# Altium schematic sheet Current Sense - AMS.SchDoc
size A4
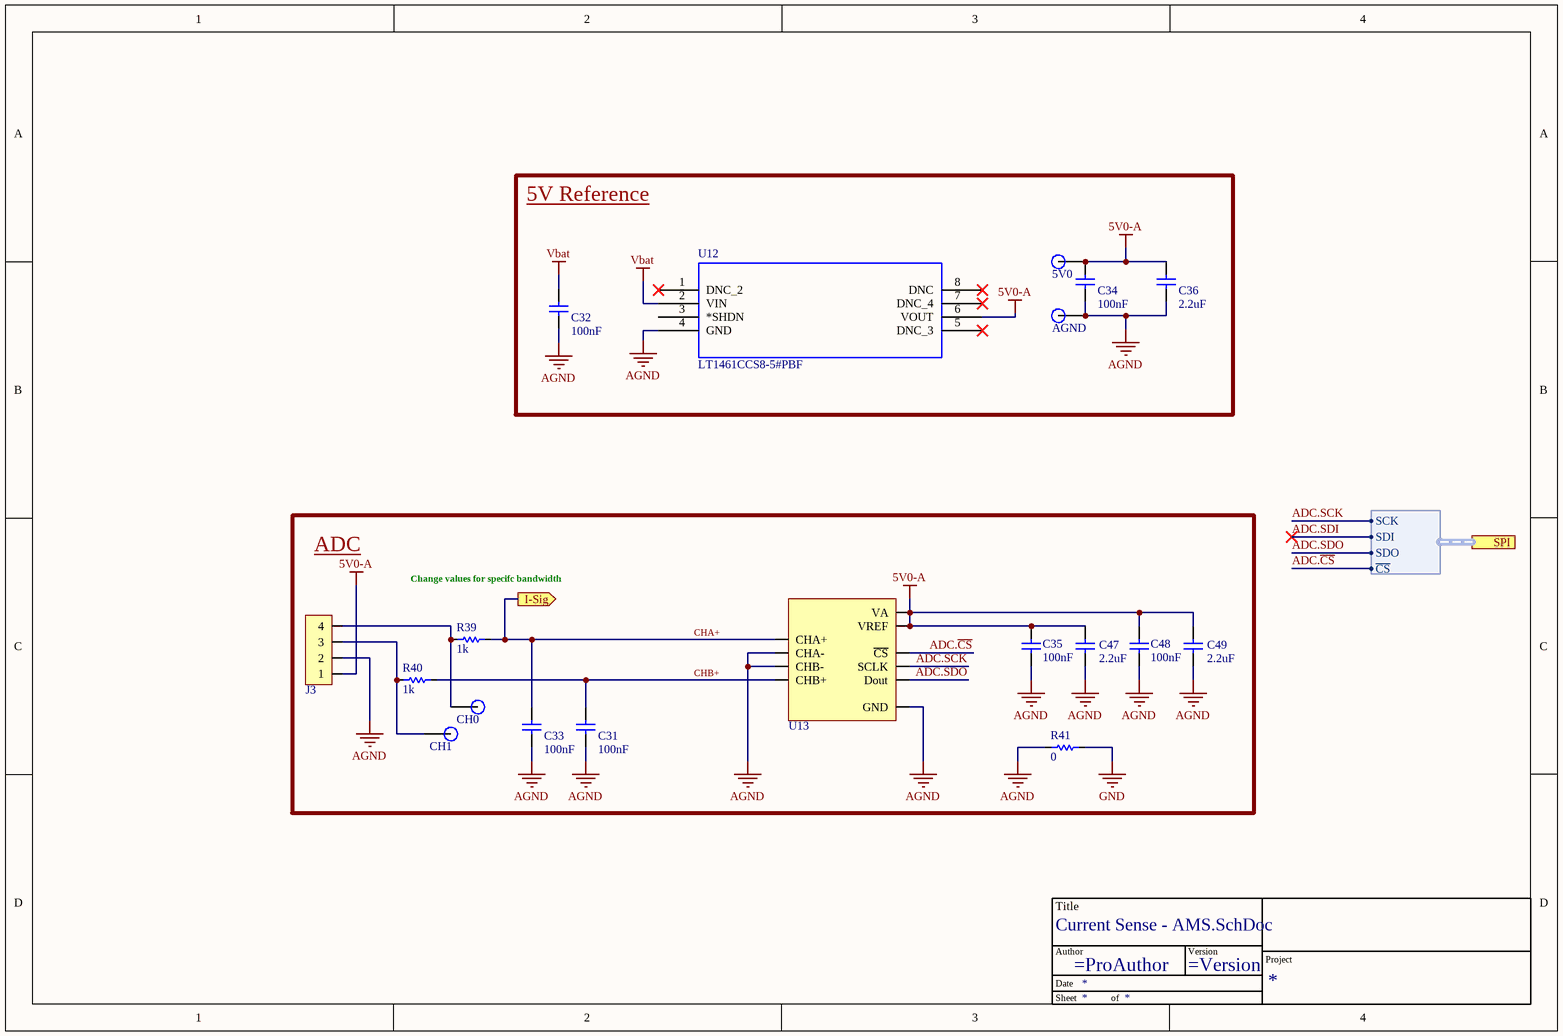
[diagram p0: Current Sense - AMS.SchDoc]

## Parts
5V0  1.2mm Test point  [Test Point]  (value not drawn)  (no BOM)
*  TitleBlock  (value not drawn)  (graphical)
AGND  1.2mm Test point  [Test Point]  (value not drawn)  (no BOM)
C31  value 100nF  [0402]  (hidden comment: C0603C104K3RAC7013)
C32  value 100nF  [C_0603]  (hidden comment: C0603C104K3RAC7013)
C33  value 100nF  [0402]  (hidden comment: C0603C104K3RAC7013)
C34  value 100nF  [C_0603]  (hidden comment: C0603C104K3RAC7013)
C35  value 100nF  [C_0603]  (hidden comment: C0603C104K3RAC7013)
C36  value 2.2uF  [C_0603]  (hidden comment: CL10A225KP8NNNC)
C47  value 2.2uF  [C_0603]  (hidden comment: CL10A225KP8NNNC)
C48  value 100nF  [C_0603]  (hidden comment: C0603C104K3RAC7013)
C49  value 2.2uF  [C_0603]  (hidden comment: CL10A225KP8NNNC)
CH0  1.2mm Test point  [Test Point]  (value not drawn)  (no BOM)
CH1  1.2mm Test point  [Test Point]  (value not drawn)  (no BOM)
J3  3-794632-4  [3-794632-4]  (value not drawn)
R39  value 1k  [R_0402]  (hidden comment: CRT0402-DY-1001GLF)
R40  value 1k  [R_0402]  (hidden comment: CRT0402-DY-1001GLF)
R41  value 0  [R-0603]  (hidden comment: AC0603JR-100RL)
U12  LT1461CCS8-5#PBF  [SO-8_S]
U13  ADC122S625CIMM/NOPB  [TSSOP50P490X110-10N]  (value not drawn)

## Blocks framed on the sheet
5V Reference: 5V0 AGND C32 C34 C36 U12
ADC: C31 C33 C35 C47-C49 CH0 CH1 J3 R39-R41 U13

## Ports
I-Sig (out), SPI (harness SPI)

## Harnesses
SPI: SDI, SDO, ~{CS}, SCK

## Nets
5V0-A: 5V0.1 C34.2 C35.2 C36.2 C47.2 C48.2 C49.2 J3.1 U12.6(VOUT) U13.1(VREF) U13.7(VA)
AGND: AGND.1 C31.1 C32.1 C33.1 C34.1 C35.1 C36.1 C47.1 C48.1 C49.1 J3.2 R41.1 U12.4(GND) U13.3(CHA-) U13.4(CHB-) U13.6(GND)
GND: R41.2
Vbat: C32.2 U12.2(VIN)
ADC.~{CS}: U13.10(~{CS}) ; port SPI.~{CS}
ADC.SCK: U13.9(SCLK) ; port SPI.SCK
ADC.SDI: port SPI.SDI
ADC.SDO: U13.8(Dout) ; port SPI.SDO
CHA+: C33.2 R39.2 U13.2(CHA+) ; port I-Sig
CHB+: C31.2 R40.2 U13.5(CHB+)
NetCH0_1: CH0.1 J3.4 R39.1
NetCH1_1: CH1.1 J3.3 R40.1

Not connected (* = marked no-connect by the designer): U12 1(DNC_2)* 3(*SHDN) 5(DNC_3)* 7(DNC_4)* 8(DNC)*

## Notes on the sheet
- Change values for specifc bandwidth
- (in symbol TitleBlock) Title; Author; Version; Project; Date; Sheet; of

## Library data of the parts
5V0 AGND CH0 CH1 = Test Point
C31-C36 C47-C49 = Capacitor: ComponentLink1Description: New link; ComponentLink1URL: *
J3 = 3-794632-4: Conn Power HDR 4 POS 3mm Solder ST Thru-Hole 4 Terminal 1 Port Box/Tray; Manufacturer: TE Connectivity; Number of Terminals/Pins: 4; Max Voltage Rating (AC): 250V; Connector Type: Pin; Mating Retention: Yes (With); PCB Mount Alignment: No (Without); Current Rating: 5A; Number of Ports: 1; Connector System: Wire-to-Board; PCB Mount Retention: With; PCB Mounting Orientation: Vertical; VDE Tested: Yes; Pitch: 0.118inch; Row Spacing: 0.118mm; PCB Thickness: 1.57mm; Plating Thickness: 2.54um; Approvals: CSA; Supplier 1: Mouser; Manufacturer Part Number: 3-794632-4; RoHS: Yes; Category: Power Connectors; Stock 1: 833; Pricing 1: 1=1.68000, 10=1.43000, 50=1.43000, 100=1.24000, 377=1.09000, 1000=1.09000, 1131=0.93600, 2639=0.87300, 5278=0.83000, 10000=0.83000, 10179=0.81100, 25259=0.79100 (USD); Mount: Through Hole; Housing Color: Black; Contact Material: Brass; Color: Black; Housing Material: Nylon; Contact Plating: Gold,Tin; Min Operating Temperature: -40°C; Max Operating Temperature: 221°C; Packaging: Tray; Package Quantity: 377; Number of Rows: 2; Fastening Type: Ramp; Orientation: Straight; Number of Positions: 4; Termination: Solder; Number of Contacts: 4; Voltage Rating: 250V; Contact Gender: Male; Mating Alignment: Yes (With); Contact Current Rating: 5A; Contact Retention: No (Without); Sealable: No (Without); Circuit Application: Power; Number of Power Positions: 4; Length: 10mm; Width: 9.24mm; Height: 8.67mm; Depth: 8.67mm; Radiation Hardening: No; Flammability Rating: UL94 V-0; Lead Free: Lead Free; ELV: Compliant; ComponentLink1URL: https://datasheet.ciiva.com/717/eng-cd-794632-e-717814.pdf?src-supplier=Digi-Key; ComponentLink1Description: https://datasheet.ciiva.com/717/eng-cd-794632-e-717814.pdf?src-supplier=Digi-Key; ComponentLink2URL: https://datasheet.ciiva.com/30185/eng-cs-82181-softshell-high-density-0508-30185662.pdf?src-supplier=Onlinecomponents.com; ComponentLink2Description: https://datasheet.ciiva.com/30185/eng-cs-82181-softshell-high-density-0508-30185662.pdf?src-supplier=Onlinecomponents.com; Supplier Part Number 1: 571-3-794632-4
R39-R41 = Resistor
U12 = LT1461ACS8-3: MF: {'manufacturer': u'Analog Devices / Linear Technology'}; Price: None; Value: *; Availability: Unavailable; MP: LT1461ACS8-3; Package: None
U13 = ADC122S625CIMM/NOPB: Analog to Digital Converters - ADC Dual 50kSPS-200kSPS 12B ADC